# Altium project Arduino幻彩灯带.PrjPcb
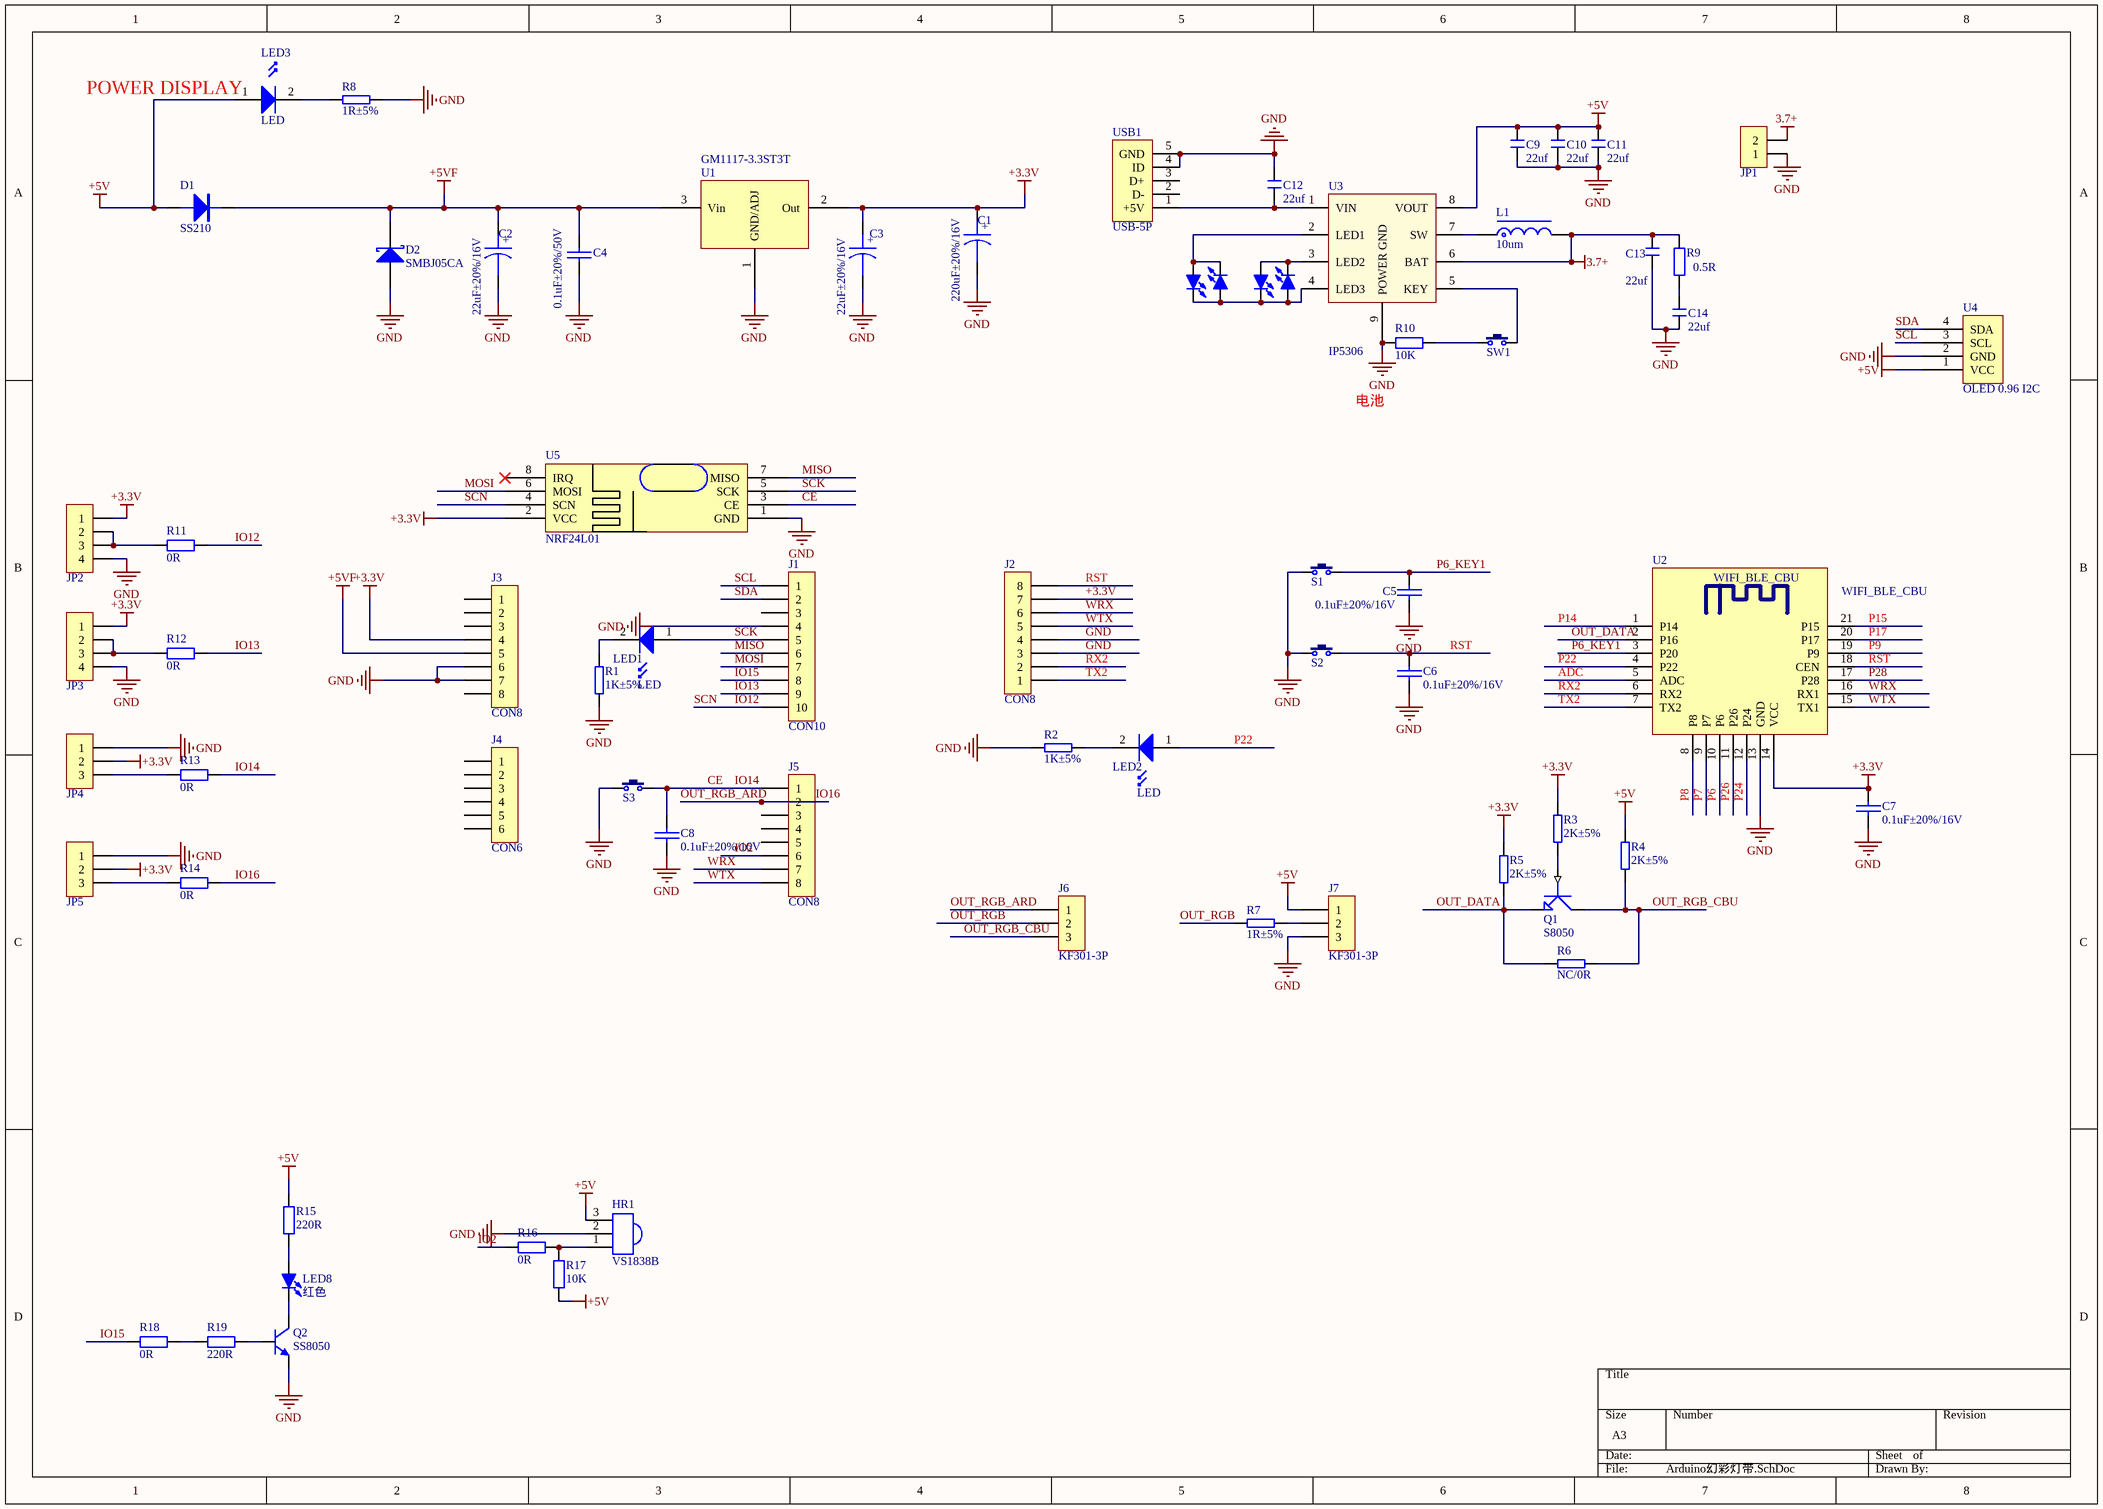
[diagram p0: Arduino幻彩灯带.SchDoc]
1 sheet, 69 parts. Net scope: global (net labels, ports and power ports of the same name join across sheets).
Board file: Arduino幻彩灯带.PcbDoc

## Sheet Arduino幻彩灯带.SchDoc
size A3

### Parts
C1  220uF±20%/16V  [CD0.15]
C2  22uF±20%/16V  [钽电容B3528]
C3  22uF±20%/16V  [钽电容B3528]
C4  0.1uF±20%/50V  [C0603]
C5  0.1uF±20%/16V  [C0603]
C6  0.1uF±20%/16V  [C0603]
C7  0.1uF±20%/16V  [C0603]
C8  0.1uF±20%/16V  [C0603]
C9  22uf  [C 0805]
C10  22uf  [C 0805]
C11  22uf  [C 0805]
C12  22uf  [C 0805]
C13  22uf  [C 0805]
C14  22uf  [C 0805]
D1  SS210  [SMA(DO-214AC)]
D2  SMBJ05CA  [SMB(DO-214AA)]
HR1  VS1838B  [VS1838B-B]
J1  CON10  [HDR1X10Z]
J2  CON8  [HDR1X8Z]
J3  CON8  [HDR1X8Z]
J4  CON6  [HDR1X6Z]
J5  CON8  [HDR1X8Z]
J6  KF301-3P  [SIP3 - 2.54]
J7  KF301-3P  [SIP3 - 2.54]
JP1  HDR-1X2  [XH2.54-2P_H]  (value not drawn)
JP2  HDR-1X4  [HDR-1X4_M]  (value not drawn)
JP3  HDR-1X4  [HDR-1X4_M]  (value not drawn)
JP4  HDR-1X3  [HDR-1X3_M]  (value not drawn)
JP5  HDR-1X3  [HDR-1X3_M]  (value not drawn)
L1  10um  [CD54]
LED1  LED  [LED0805_1]
LED2  LED  [LED0805_1]
LED3  LED  [LED0805_1]
LED4  蓝色  [LED 0805B]  (value not drawn)
LED5  蓝色  [LED 0805B]  (value not drawn)
LED6  蓝色  [LED 0805B]  (value not drawn)
LED7  蓝色  [LED 0805B]  (value not drawn)
LED8  红色  [LED 5MM-B]
Q1  S8050  [SOT-23-NPN]
Q2  SS8050  [SOT23-3N]
R1  1K±5%  [R0603]
R2  1K±5%  [R0603]
R3  2K±5%  [R0603]
R4  2K±5%  [R0603]
R5  2K±5%  [R0603]
R6  NC/0R  [R0603]
R7  1R±5%  [R0603]
R8  1R±5%  [R0603]
R9  0.5R  [R 0805]
R10  10K  [R 0805]
R11  0R  [R 0603]
R12  0R  [R 0603]
R13  0R  [R 0603]
R14  0R  [R 0603]
R15  220R  [R 0603]
R16  0R  [R 0603]
R17  10K  [R 0603]
R18  0R  [R 0603]
R19  220R  [R 0603]
S1  3x6x5  [TSW SMD-3*6*2.5]  (value not drawn)
S2  3x6x5  [TSW SMD-3*6*2.5]  (value not drawn)
S3  3x6x5  [TSW SMD-3*6*2.5]  (value not drawn)
SW1  3x6x5  [TSW SMD-3*6*2.5]  (value not drawn)
U1  GM1117-3.3ST3T  [SOT-223]
U2  WIFI_BLE_CBU  [WIFI_BLE_CBU]
U3  IP5306  [5306]
U4  OLED 0.96 I2C  [OLED 0.96 I2C]
U5  NRF24L01  [NRF24L01]
USB1  USB-5P  [USB-MICRO_B]

### Nets
3.7+: C13.2 JP1.2 L1.2 R9.2 U3.6(BAT)
+3.3V: C1.1 C3.1 C7.2 J2.7 J3.4 JP2.1 JP3.1 JP4.2 JP5.2 R3.1 R5.1 U1.2(Out) U2.14(VCC) U5.2(VCC)
+5V: C9.2 C10.2 C11.2 D1.1 HR1.3(E) J7.1 LED3.1 R4.1 R15.2 R17.1 U3.8(VOUT) U4.1(VCC)
+5VF: C2.1 C4.1 D1.2 D2.2(K) J3.5 U1.3(Vin)
GND: C1.2 C2.2 C3.2 C4.2 C5.1 C6.2 C7.1 C8.1 C9.1 C10.1 C11.1 C12.2 C13.1 C14.1 D2.1(A) HR1.2(K) J1.4 J2.3 J2.4 J3.6 J3.7 J7.3 JP1.1 JP2.4 JP3.4 JP4.1 JP5.1 Q2.2(E) R1.1 R2.2 R8.2 R10.1 S1.1 S2.1 S3.1 U1.1(GND/ADJ) U2.13(GND) U3.9(POWER_GND) U4.2(GND) U5.1(GND) USB1.4(ID) USB1.5(GND)
ADC: U2.5(ADC)
CE: C8.2 J5.1 R13.2 S3.2 U5.3(CE)  [also labelled IO14]
IO2: J5.6 R16.1
IO12: J1.10 R11.2 U5.4(SCN)  [also labelled SCN]
IO13: J1.9 R12.2
IO15: J1.8 R18.1
IO16: J5.2 J6.1 R14.2  [also labelled OUT_RGB_ARD]
MISO: J1.6 U5.7(MISO)
MOSI: J1.7 U5.6(MOSI)
OUT_DATA: Q1.1(E) R5.2 R6.1 U2.2(P16)
OUT_RGB: J6.2 R7.1
OUT_RGB_CBU: J6.3 Q1.3(C) R4.2 R6.2
P6: U2.10(P6)
P6_KEY1: C5.2 S1.2 U2.3(P20)
P7: U2.9(P7)
P8: U2.8(P8)
P9: U2.19(P9)
P14: U2.1(P14)
P15: U2.21(P15)
P17: U2.20(P17)
P22: LED2.1 U2.4(P22)
P24: U2.12(P24)
P26: U2.11(P26)
P28: U2.17(P28)
RST: C6.1 J2.8 S2.2 U2.18(CEN)
RX2: J2.2 U2.6(RX2)
SCK: J1.5 LED1.1 U5.5(SCK)
SCL: J1.1 U4.3(SCL)
SDA: J1.2 U4.4(SDA)
TX2: J2.1 U2.7(TX2)
WRX: J2.6 J5.7 U2.16(RX1)
WTX: J2.5 J5.8 U2.15(TX1)
NetC12_1: C12.1 U3.1(VIN) USB1.1(+5V)
NetC14_2: C14.2 R9.1
NetHR1_1: HR1.1(A) R16.2 R17.2
NetJ7_2: J7.2 R7.2
NetJP2_2: JP2.2 JP2.3 R11.1
NetJP3_2: JP3.2 JP3.3 R12.1
NetJP4_3: JP4.3 R13.1
NetJP5_3: JP5.3 R14.1
NetL1_1: L1.1 U3.7(SW)
NetLED1_2: LED1.2 R1.2
NetLED2_2: LED2.2 R2.1
NetLED3_2: LED3.2 R8.1
NetLED4_1: LED4.1(A) LED5.1(A) LED6.2(K) LED7.2(K) U3.4(LED3)
NetLED4_2: LED4.2(K) LED6.1(A) U3.2(LED1)
NetLED5_2: LED5.2(K) LED7.1(A) U3.3(LED2)
NetLED8_1: LED8.1(A) R15.1
NetLED8_2: LED8.2(K) Q2.3(C)
NetQ1_2: Q1.2(B) R3.2
NetQ2_1: Q2.1(B) R19.2
NetR10_2: R10.2 SW1.1
NetR18_2: R18.2 R19.1
NetSW1_2: SW1.2 U3.5(KEY)

Not connected (* = marked no-connect by the designer): J1 3; J3 1 2 3 8; J4 1 2 3 4 5 6; J5 3 4 5; U5 8(IRQ)*; USB1 2(D-) 3(D+)

### Notes on the sheet
- (near LED3) POWER DISPLAY
- 电池
- (in symbol CAPACITOR POL) +

### Library data of the parts
C1-C3 = CAPACITOR POL: Capacitor
C4-C8 = CAP: Capacitor
C9-C14 = C: 无极性贴片电容; 版权归属: 源创客; BOM名称: 无极性贴片电容; 学习资源: www.ooocke.com
D1 = Diode1: Diode
D2 = D Schottky: Schottky Diode; MFR: Toshiba
HR1 = VS1838B: 红外接收头; 版权归属: 源创客; BOM名称: 红外接收头; 学习资源: www.ooocke.com
J1 = CON10: Connector
J2 J3 J5 = CON8: Connector
J4 = CON6: Connector
J6 J7 = CON3: Connector
JP1 = Header 2: 2P接插件; 版权归属: 源创客; BOM名称: 2P接插件; 学习资源: www.ooocke.com
JP2 JP3 = Header 4: 4P接插件; 版权归属: 源创客; BOM名称: 4P接插件; 学习资源: www.ooocke.com
JP4 JP5 = Header 3: 3P接插件; 版权归属: 源创客; BOM名称: 3P接插件; 学习资源: www.ooocke.com
L1 = L-CD: 贴片功率电感; BOM名称: 功率电感; 版权归属: 源创客; 学习资源: www.ooocke.com
LED4-LED7 = LED-SMD: 贴片LED; 版权归属: 源创客; BOM名称: 贴片LED; 学习资源: www.ooocke.com
LED8 = LED-5MM: 5mm插件LED; 版权归属: 源创客; BOM名称: 5mm插件LED; 学习资源: www.ooocke.com
Q1 = NPN: NPN Transistor
Q2 = 8050-SMD: 高频放大-NPN型; 版权归属: 源创客; 属性: 40V 1.5A 1W 100MHZ; BOM名称: 高频放大-NPN型; 学习资源: www.ooocke.com
R1-R8 = RES5
R9-R19 = R: 贴片电阻; 版权归属: 源创客; BOM名称: 贴片电阻; 学习资源: www.ooocke.com
S1-S3 SW1 = TSW 3x6: 3x6轻触开关; 版权归属: 源创客; BOM名称: 3x6轻触开关; 学习资源: www.ooocke.com
U1 = GM1117
U2 = WIFI_BLE_CBU: Module
U3 = IP5306: 锂电池充放电管理芯片
U5 = NRF24L01: 2.4G无线模块
USB1 = USB-5P: 微型USB母座; 版权归属: 源创客; BOM名称: 微型USB母座; 学习资源: www.ooocke.com
LED1-LED3 = LED: Published: *; LatestRevisionDate: *; LatestRevisionNote: *; DatasheetDocument: *; PackageDocument: *; PackageReference: *; Publisher: *; ComponentLink1Description: *; ComponentLink1URL: *; Code_JEDEC: *